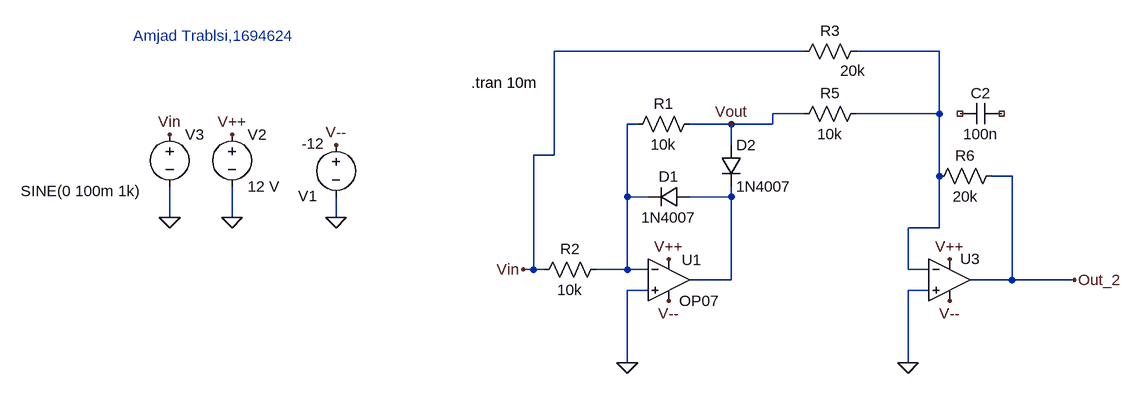
[diagram p0: schematic 4_2_zweiwegGR.asc]
4_2_zweiwegGR.asc, the LTspice schematic file:
Version 4
SHEET 1 1384 680
WIRE 880 0 496 0
WIRE 1088 0 960 0
WIRE 880 96 832 96
WIRE 1088 96 1088 0
WIRE 1088 96 960 96
WIRE 624 112 608 112
WIRE 768 112 704 112
WIRE 832 112 832 96
WIRE 832 112 768 112
WIRE 768 144 768 112
WIRE 496 160 496 0
WIRE 496 160 464 160
WIRE 1088 192 1088 96
WIRE 1200 192 1168 192
WIRE 608 224 608 112
WIRE 640 224 608 224
WIRE 768 224 768 208
WIRE 768 224 704 224
WIRE -96 256 -96 208
WIRE 0 256 0 208
WIRE 160 256 160 224
WIRE 1088 272 1088 192
WIRE 1088 272 1040 272
WIRE 464 336 464 160
WIRE 464 336 448 336
WIRE 480 336 464 336
WIRE 608 336 608 224
WIRE 608 336 560 336
WIRE 640 336 608 336
WIRE 1040 336 1040 272
WIRE 1072 336 1040 336
WIRE 768 352 768 224
WIRE 768 352 704 352
WIRE 1200 352 1200 192
WIRE 1200 352 1136 352
WIRE 1296 352 1200 352
WIRE 640 368 608 368
WIRE 1072 368 1040 368
WIRE 608 480 608 368
WIRE 1040 480 1040 368
FLAG 608 480 0
FLAG 0 256 0
FLAG -96 256 0
FLAG 0 128 V++
FLAG 672 384 V--
FLAG -96 128 Vin
FLAG 448 336 Vin
FLAG 768 112 Vout
FLAG 160 256 0
FLAG 160 144 V--
FLAG 1040 480 0
FLAG 672 320 V++
FLAG 1104 320 V++
FLAG 1104 384 V--
FLAG 1296 352 Out_2
SYMBOL res 720 96 R90
WINDOW 0 0 56 VBottom 2
WINDOW 3 32 56 VTop 2
SYMATTR InstName R1
SYMATTR Value 10k
SYMBOL diode 704 208 R90
WINDOW 0 0 32 VBottom 2
WINDOW 3 32 32 VTop 2
SYMATTR InstName D1
SYMATTR Value 1N4007
SYMBOL diode 752 144 R0
SYMATTR InstName D2
SYMATTR Value 1N4007
SYMBOL res 576 320 R90
WINDOW 0 0 56 VBottom 2
WINDOW 3 32 56 VTop 2
SYMATTR InstName R2
SYMATTR Value 10k
SYMBOL voltage 160 128 R0
WINDOW 0 -58 95 Left 2
WINDOW 3 -53 14 Left 2
WINDOW 123 0 0 Left 0
WINDOW 39 0 0 Left 0
SYMATTR InstName V1
SYMATTR Value -12
SYMBOL voltage 0 112 R0
WINDOW 123 0 0 Left 0
WINDOW 39 0 0 Left 0
SYMATTR InstName V2
SYMATTR Value 12 V
SYMBOL voltage -96 112 R0
WINDOW 3 -229 103 Left 2
WINDOW 123 0 0 Left 0
WINDOW 39 0 0 Left 0
SYMATTR InstName V3
SYMATTR Value SINE(0 100m 1k)
SYMBOL OpAmps\\OP07 672 288 R0
WINDOW 0 20 33 Left 2
SYMATTR InstName U1
SYMBOL res 976 -16 R90
WINDOW 0 0 56 VBottom 2
WINDOW 3 30 21 VTop 2
SYMATTR InstName R3
SYMATTR Value 20k
SYMBOL res 976 80 R90
WINDOW 0 0 56 VBottom 2
WINDOW 3 32 56 VTop 2
SYMATTR InstName R5
SYMATTR Value 10k
SYMBOL res 1184 176 R90
WINDOW 0 0 56 VBottom 2
WINDOW 3 32 56 VTop 2
SYMATTR InstName R6
SYMATTR Value 20k
SYMBOL OpAmps\\UniversalOpAmp 1104 352 R0
SYMATTR InstName U3
SYMBOL cap 1184 80 R90
WINDOW 0 0 32 VBottom 2
WINDOW 3 32 32 VTop 2
SYMATTR InstName C2
SYMATTR Value 100n
TEXT 368 48 Left 2 !.tran 10m
TEXT -152 -24 Left 2 ;Amjad Trablsi,1694624

The netlist it stands for:
* 4_2_zweiwegGR.asc
R1 Vout N002 10k
D1 N003 N002 1N4007
D2 Vout N003 1N4007
R2 N002 Vin 10k
V1 V-- 0 -12
V2 V++ 0 12 V
V3 Vin 0 SINE(0 100m 1k)
XU1 0 N002 V++ V-- N003 LT1001  ; OP07, pins In+ In- V+ V- OUT
R3 N001 Vin 20k
R5 N001 Vout 10k
R6 Out_2 N001 20k
XU3 0 N001 V++ V-- Out_2 level1 Avol=1Meg GBW=10Meg Vos=0 En=0 Enk=0 In=0 Ink=0 Rin=500Meg  ; pins In+ In- V+ V- OUT
C2 NC_01 NC_02 100n
.model D D
.lib standard.dio
.tran 10m
* Amjad Trablsi,1694624
.lib LTC.lib
.lib UniversalOpAmp1.lib
.backanno
.end